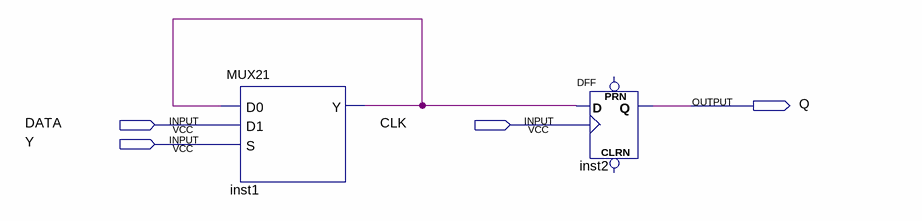
[diagram p0: schematic sheet]
// Quartus schematic Register.bdf as structural Verilog: 2 symbols, 4 pins
module Register (
  input  DATA,
  input  CLK,
  input  Y,
  output Q
);

  wire inst1_y;

  MUX21 inst1 (.D0(inst1_y), .D1(DATA), .S(Y), .Y(inst1_y));
  DFF inst2 (.CLK(CLK), .D(inst1_y), .Q(Q));  // open: CLRN, PRN
endmodule
